# Altium schematic sheet Sheet_1_2021-01-20 (1).schdoc
size 49 x 28 mm
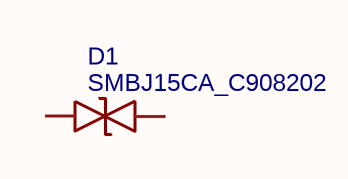
[diagram p0: Sheet_1_2021-01-20 (1).schdoc]

## Parts
D1  SMBJ15CA_C908202  [SMB_L4.6-W3.6-LS5.3-BI]

## Nets

Not connected (* = marked no-connect by the designer): D1 1 2

## Library data of the parts
D1 = SMBJ15CA_C908202: BOM_Manufacturer: FUXINSEMI; Contributor: LCSC; BOM_Supplier: LCSC; BOM_Supplier Part: C908202; BOM_Manufacturer Part: SMBJ15CA; spicePre: D; spiceSymbolName: SMBJ15CA_C908202